# Altium project BencsikDanielZoltan_A7.PrjPcb
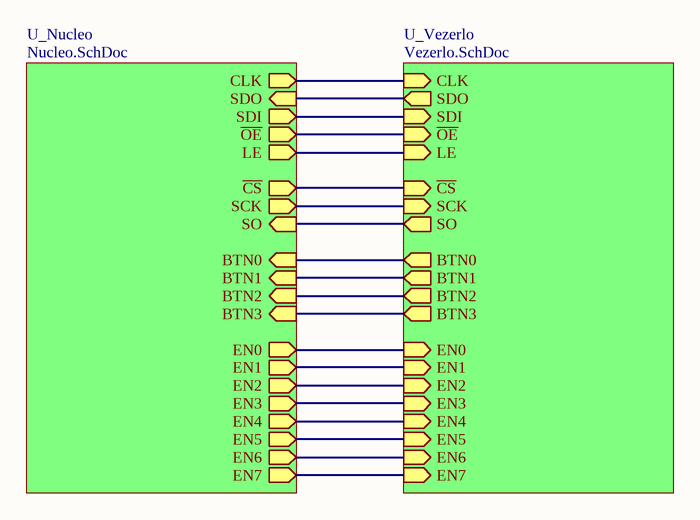
[diagram p0: TOP.SchDoc]
4 sheets, 101 parts. Net scope: hierarchical (ports join the sheet entries above them; power ports are global).
Board file: hazi_kiindulas.PcbDoc
Sheets:
  TOP.SchDoc
    U_Nucleo = Nucleo.SchDoc
    U_Vezerlo = Vezerlo.SchDoc
      U_Ledsor1 = Ledsor.SchDoc
      U_Ledsor2 = Ledsor.SchDoc
      U_Ledsor3 = Ledsor.SchDoc
      U_Ledsor4 = Ledsor.SchDoc
      U_Ledsor5 = Ledsor.SchDoc
      U_Ledsor6 = Ledsor.SchDoc
      U_Ledsor7 = Ledsor.SchDoc
      U_Ledsor8 = Ledsor.SchDoc

## Sheet TOP.SchDoc: LED Matrix
size A4; Author: Bencsik Dániel Zoltán; Organization: BME-AUT; DocumentNumber: 1; Revision: R7; SheetNumber: 1; SheetTotal: 4

### Sub-sheets
U_Nucleo = Nucleo.SchDoc: EN1 (out), EN2 (out), EN3 (out), EN4 (out), EN5 (out), EN6 (out), EN7 (out), EN0 (out), SDI (out), CLK (out), LE (out), ~{OE} (out), SDO (in), ~{CS} (out), SCK (out), SO (in), BTN0 (in), BTN1 (in), BTN2 (in), BTN3 (in)
U_Vezerlo = Vezerlo.SchDoc: SDI (in), CLK (in), LE (in), ~{OE} (in), EN0 (in), EN1 (in), EN2 (in), EN3 (in), EN4 (in), EN5 (in), EN6 (in), EN7 (in), SDO (out), ~{CS} (in), SCK (in), SO (out), BTN0 (out), BTN1 (out), BTN2 (out), BTN3 (out)

### Nets
SPI1_MISO: sheet U_Nucleo/SDO, sheet U_Vezerlo/SDO
SPI1_MOSI: sheet U_Nucleo/SDI, sheet U_Vezerlo/SDI
SPI1_SCK: sheet U_Nucleo/CLK, sheet U_Vezerlo/CLK
SPI2_MISO: sheet U_Nucleo/SO, sheet U_Vezerlo/SO
SPI2_NSS: sheet U_Nucleo/~{CS}, sheet U_Vezerlo/~{CS}
SPI2_SCK: sheet U_Nucleo/SCK, sheet U_Vezerlo/SCK
SR_LE: sheet U_Nucleo/LE, sheet U_Vezerlo/LE
SR_~{OE}: sheet U_Nucleo/~{OE}, sheet U_Vezerlo/~{OE}
NetB0_3: sheet U_Nucleo/BTN0, sheet U_Vezerlo/BTN0
NetB1_3: sheet U_Nucleo/BTN1, sheet U_Vezerlo/BTN1
NetB2_3: sheet U_Nucleo/BTN2, sheet U_Vezerlo/BTN2
NetB3_3: sheet U_Nucleo/BTN3, sheet U_Vezerlo/BTN3
NetR7A_1: sheet U_Nucleo/EN0, sheet U_Vezerlo/EN0
NetR7B_1: sheet U_Nucleo/EN1, sheet U_Vezerlo/EN1
NetR7C_1: sheet U_Nucleo/EN2, sheet U_Vezerlo/EN2
NetR7D_1: sheet U_Nucleo/EN3, sheet U_Vezerlo/EN3
NetR7E_1: sheet U_Nucleo/EN4, sheet U_Vezerlo/EN4
NetR7F_1: sheet U_Nucleo/EN5, sheet U_Vezerlo/EN5
NetR7G_1: sheet U_Nucleo/EN6, sheet U_Vezerlo/EN6
NetR7H_1: sheet U_Nucleo/EN7, sheet U_Vezerlo/EN7

### Notes on the sheet
- Title
- Size:
- Date:
- A4
- Number:
- Time:
- Revision:
- Sheet
- of
- File:

## Sheet Nucleo.SchDoc: LED Matrix
size A4; Author: Bencsik Dániel Zoltán; Organization: BME-AUT; DocumentNumber: 2; Revision: A7; SheetNumber: 2; SheetTotal: 4
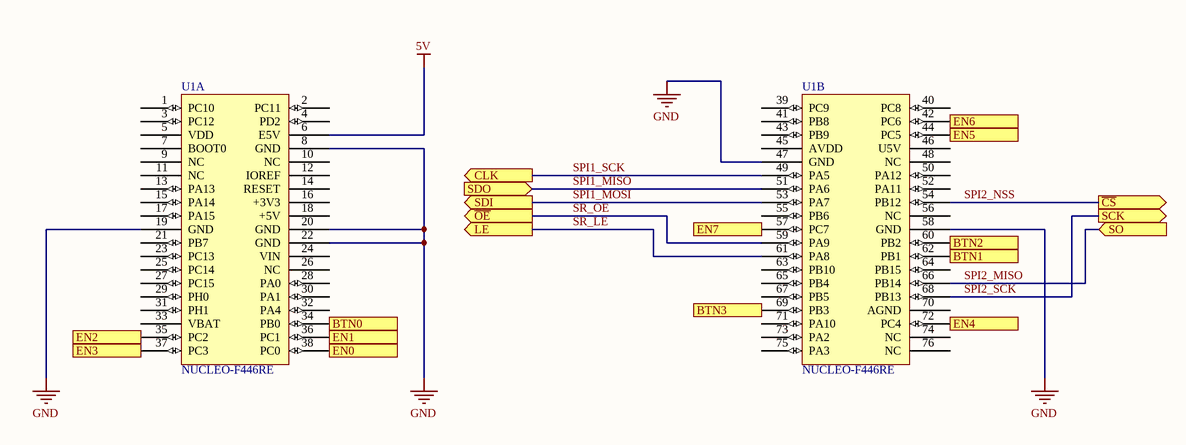
[diagram p1: Nucleo.SchDoc]

### Parts
U1  NUCLEO-F446RE  [FP_NUCLEO-64]  (parts A,B of 2)

### Ports
BTN0 (in), BTN1 (in), BTN2 (in), BTN3 (in), CLK (out), EN0 (out), EN1 (out), EN2 (out), EN3 (out), EN4 (out), EN5 (out), EN6 (out), EN7 (out), LE (out), SCK (out), SDI (out), SDO (in), SO (in), ~{CS} (out), ~{OE} (out)

### Nets
5V: U1.6(E5V)
GND: U1.8(GND) U1.19(GND) U1.20(GND) U1.22(GND) U1.47(GND) U1.58(GND)
SPI1_MISO: U1.51(PA6) ; port SDO
SPI1_MOSI: U1.53(PA7) ; port SDI
SPI1_SCK: U1.49(PA5) ; port CLK
SPI2_MISO: U1.66(PB14) ; port SO
SPI2_NSS: U1.54(PB12) ; port ~{CS}
SPI2_SCK: U1.68(PB13) ; port SCK
SR_LE: U1.61(PA8) ; port LE
SR_~{OE}: U1.59(PA9) ; port ~{OE}
NetB0_3: U1.34(PB0) ; port BTN0
NetB1_3: U1.62(PB1) ; port BTN1
NetB2_3: U1.60(PB2) ; port BTN2
NetB3_3: U1.69(PB3) ; port BTN3
NetR7A_1: U1.38(PC0) ; port EN0
NetR7B_1: U1.36(PC1) ; port EN1
NetR7C_1: U1.35(PC2) ; port EN2
NetR7D_1: U1.37(PC3) ; port EN3
NetR7E_1: U1.72(PC4) ; port EN4
NetR7F_1: U1.44(PC5) ; port EN5
NetR7G_1: U1.42(PC6) ; port EN6
NetR7H_1: U1.57(PC7) ; port EN7

Not connected (* = marked no-connect by the designer): U1 1(PC10) 2(PC11) 3(PC12) 4(PD2) 5(VDD) 7(BOOT0) 9(NC) 10(NC) 11(NC) 12(IOREF) 13(PA13) 14(RESET) 15(PA14) 16(+3V3) 17(PA15) 18(+5V) 21(PB7) 23(PC13) 24(VIN) 25(PC14) 26(NC) 27(PC15) 28(PA0) 29(PH0) 30(PA1) 31(PH1) 32(PA4) 33(VBAT) 39(PC9) 40(PC8) 41(PB8) 43(PB9) 45(AVDD) 46(U5V) 48(NC) 50(PA12) 52(PA11) 55(PB6) 56(NC) 63(PB10) 64(PB15) 65(PB4) 67(PB5) 70(AGND) 71(PA10) 73(PA2) 74(NC) 75(PA3) 76(NC)

### Notes on the sheet
- Title
- Size:
- Date:
- A4
- Number:
- Time:
- Revision:
- Sheet
- of
- File:

### Library data of the parts
U1 = NUCLEO-F446RE: Reference: NUCLEO; Name: Nucleo F446RE; Supplier: Tanszék

## Sheet Vezerlo.SchDoc: LED Matrix
size A4; Author: Bencsik Dániel Zoltán; Organization: BME-AUT; DocumentNumber: 3; Revision: A7; SheetNumber: 3; SheetTotal: 4
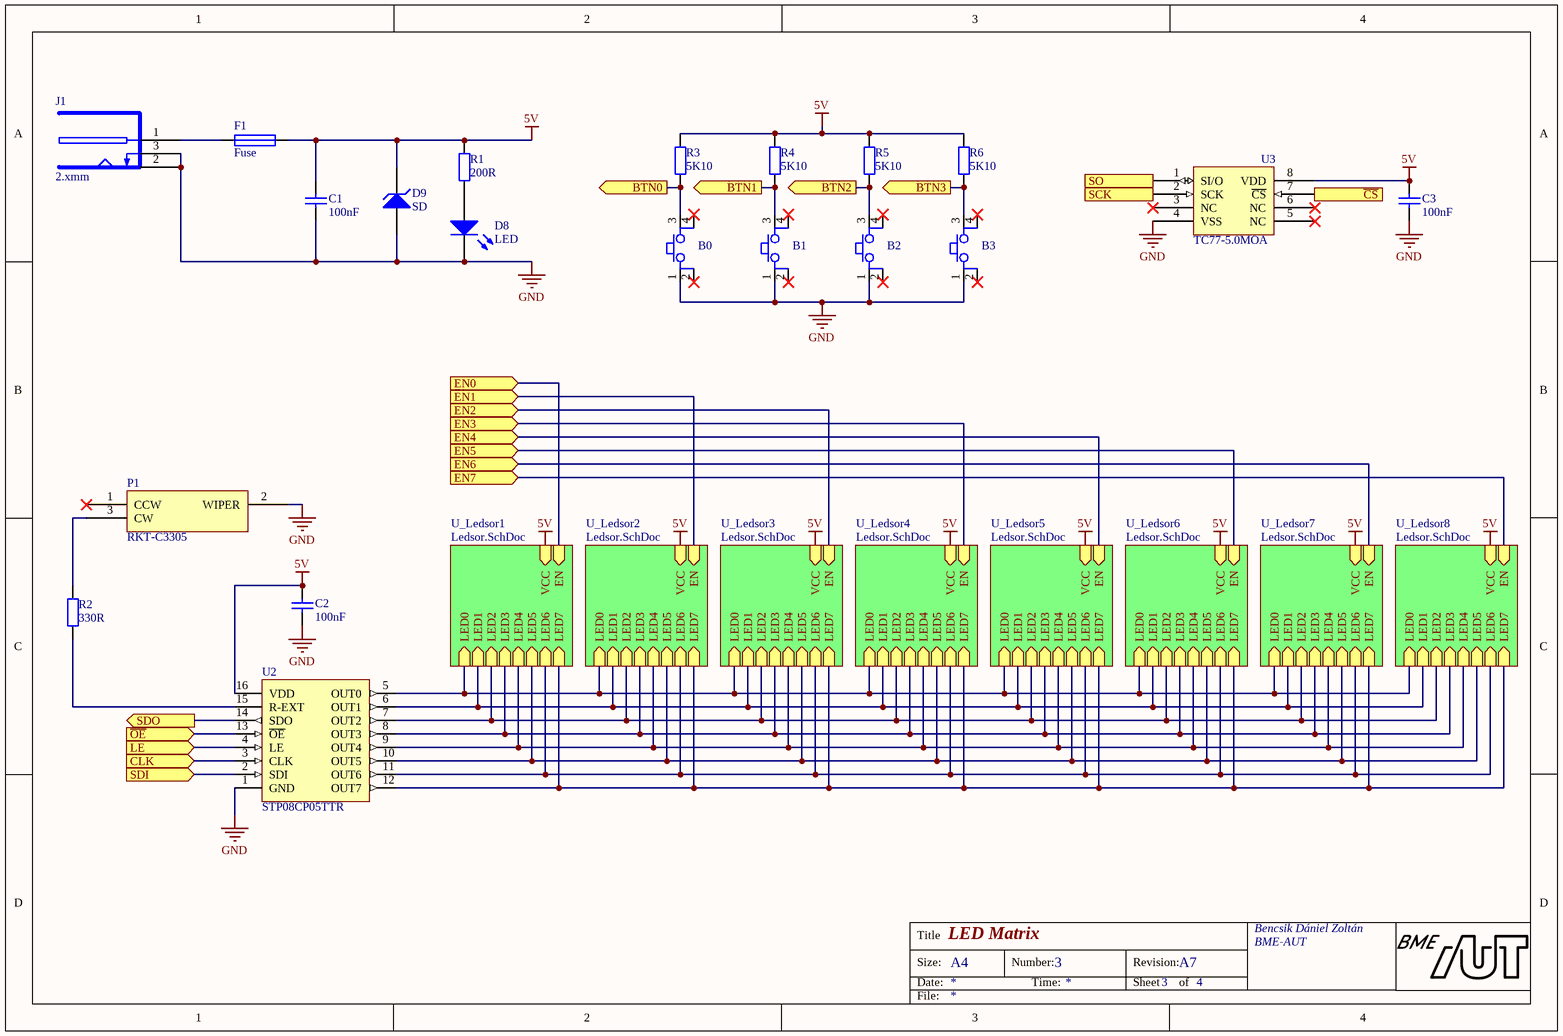
[diagram p2: Vezerlo.SchDoc]

### Parts
B0  Button  [FP_BTN_SMD]  (value not drawn)
B1  Button  [FP_BTN_SMD]  (value not drawn)
B2  Button  [FP_BTN_SMD]  (value not drawn)
B3  Button  [FP_BTN_SMD]  (value not drawn)
C1  100nF  [FP_0603_CAP_080]
C2  100nF  [FP_0603_CAP_080]
C3  100nF  [FP_0603_CAP_080]
D8  LED  [HF_FP_0805_LED_BLUE&RED_2]
D9  SD  [FP_SMA]
F1  Fuse  [FP_MULTIFUSE]
J1  2.xmm  [FP_DC_TAP_ANYA]
P1  RKT-C3305  [HF_POT]
R1  200R  [HF_FP_0603_RES]
R2  330R  [HF_FP_0603_RES]
R3  5K10  [HF_FP_0603_RES]
R4  5K10  [HF_FP_0603_RES]
R5  5K10  [HF_FP_0603_RES]
R6  5K10  [HF_FP_0603_RES]
U2  STP08CP05TTR  [TSOP65P640X120-16M]
U3  TC77-5.0MOA  [HF_SOIC127P599X175-8N]

### Sub-sheets
U_Ledsor1 = Ledsor.SchDoc: LED0 (in), LED1 (in), LED2 (in), LED3 (in), LED4 (in), LED5 (in), LED6 (in), LED7 (in), EN (in), VCC (in)
U_Ledsor2 = Ledsor.SchDoc: LED0 (in), LED1 (in), LED2 (in), LED3 (in), LED4 (in), LED5 (in), LED6 (in), LED7 (in), EN (in), VCC (in)
U_Ledsor3 = Ledsor.SchDoc: LED0 (in), LED1 (in), LED2 (in), LED3 (in), LED4 (in), LED5 (in), LED6 (in), LED7 (in), EN (in), VCC (in)
U_Ledsor4 = Ledsor.SchDoc: LED0 (in), LED1 (in), LED2 (in), LED3 (in), LED4 (in), LED5 (in), LED6 (in), LED7 (in), EN (in), VCC (in)
U_Ledsor5 = Ledsor.SchDoc: LED0 (in), LED1 (in), LED2 (in), LED3 (in), LED4 (in), LED5 (in), LED6 (in), LED7 (in), EN (in), VCC (in)
U_Ledsor6 = Ledsor.SchDoc: LED0 (in), LED1 (in), LED2 (in), LED3 (in), LED4 (in), LED5 (in), LED6 (in), LED7 (in), EN (in), VCC (in)
U_Ledsor7 = Ledsor.SchDoc: LED0 (in), LED1 (in), LED2 (in), LED3 (in), LED4 (in), LED5 (in), LED6 (in), LED7 (in), EN (in), VCC (in)
U_Ledsor8 = Ledsor.SchDoc: LED0 (in), LED1 (in), LED2 (in), LED3 (in), LED4 (in), LED5 (in), LED6 (in), LED7 (in), EN (in), VCC (in)

### Ports
BTN0 (out), BTN1 (out), BTN2 (out), BTN3 (out), CLK (in), EN0 (in), EN1 (in), EN2 (in), EN3 (in), EN4 (in), EN5 (in), EN6 (in), EN7 (in), LE (in), SCK (in), SDI (in), SDO (out), SO (out), ~{CS} (in), ~{OE} (in)

### Nets
5V: C1.2 C2.2 C3.2 D9.K F1.2 R1.2 R3.2 R4.2 R5.2 R6.2 U2.16(VDD) U3.8(VDD) ; sheet U_Ledsor1/VCC, sheet U_Ledsor2/VCC, sheet U_Ledsor3/VCC, sheet U_Ledsor4/VCC, sheet U_Ledsor5/VCC, sheet U_Ledsor6/VCC, sheet U_Ledsor7/VCC, sheet U_Ledsor8/VCC
GND: B0.1 B1.1 B2.1 B3.1 C1.1 C2.1 C3.1 D8.K D9.A J1.2(SLEEVE) J1.3(BREAK) P1.2(WIPER) U2.1(GND) U3.4(VSS)
SPI1_MISO: U2.14(SDO) ; port SDO
SPI1_MOSI: U2.2(SDI) ; port SDI
SPI1_SCK: U2.3(CLK) ; port CLK
SPI2_MISO: U3.1(SI/O) ; port SO
SPI2_NSS: U3.7(~{CS}) ; port ~{CS}
SPI2_SCK: U3.2(SCK) ; port SCK
SR_LE: U2.4(LE) ; port LE
SR_~{OE}: U2.13(~{OE}) ; port ~{OE}
NetB0_3: B0.3 R3.1 ; port BTN0
NetB1_3: B1.3 R4.1 ; port BTN1
NetB2_3: B2.3 R5.1 ; port BTN2
NetB3_3: B3.3 R6.1 ; port BTN3
NetD0#1_K: U2.5(OUT0) ; sheet U_Ledsor1/LED0, sheet U_Ledsor2/LED0, sheet U_Ledsor3/LED0, sheet U_Ledsor4/LED0, sheet U_Ledsor5/LED0, sheet U_Ledsor6/LED0, sheet U_Ledsor7/LED0, sheet U_Ledsor8/LED0
NetD1#1_K: U2.6(OUT1) ; sheet U_Ledsor1/LED1, sheet U_Ledsor2/LED1, sheet U_Ledsor3/LED1, sheet U_Ledsor4/LED1, sheet U_Ledsor5/LED1, sheet U_Ledsor6/LED1, sheet U_Ledsor7/LED1, sheet U_Ledsor8/LED1
NetD2#1_K: U2.7(OUT2) ; sheet U_Ledsor1/LED2, sheet U_Ledsor2/LED2, sheet U_Ledsor3/LED2, sheet U_Ledsor4/LED2, sheet U_Ledsor5/LED2, sheet U_Ledsor6/LED2, sheet U_Ledsor7/LED2, sheet U_Ledsor8/LED2
NetD3#1_K: U2.8(OUT3) ; sheet U_Ledsor1/LED3, sheet U_Ledsor2/LED3, sheet U_Ledsor3/LED3, sheet U_Ledsor4/LED3, sheet U_Ledsor5/LED3, sheet U_Ledsor6/LED3, sheet U_Ledsor7/LED3, sheet U_Ledsor8/LED3
NetD4#1_K: U2.9(OUT4) ; sheet U_Ledsor1/LED4, sheet U_Ledsor2/LED4, sheet U_Ledsor3/LED4, sheet U_Ledsor4/LED4, sheet U_Ledsor5/LED4, sheet U_Ledsor6/LED4, sheet U_Ledsor7/LED4, sheet U_Ledsor8/LED4
NetD5#1_K: U2.10(OUT5) ; sheet U_Ledsor1/LED5, sheet U_Ledsor2/LED5, sheet U_Ledsor3/LED5, sheet U_Ledsor4/LED5, sheet U_Ledsor5/LED5, sheet U_Ledsor6/LED5, sheet U_Ledsor7/LED5, sheet U_Ledsor8/LED5
NetD6#1_K: U2.11(OUT6) ; sheet U_Ledsor1/LED6, sheet U_Ledsor2/LED6, sheet U_Ledsor3/LED6, sheet U_Ledsor4/LED6, sheet U_Ledsor5/LED6, sheet U_Ledsor6/LED6, sheet U_Ledsor7/LED6, sheet U_Ledsor8/LED6
NetD7#1_K: U2.12(OUT7) ; sheet U_Ledsor1/LED7, sheet U_Ledsor2/LED7, sheet U_Ledsor3/LED7, sheet U_Ledsor4/LED7, sheet U_Ledsor5/LED7, sheet U_Ledsor6/LED7, sheet U_Ledsor7/LED7, sheet U_Ledsor8/LED7
NetD8_A: D8.A R1.1
NetF1_1: F1.1 J1.1(PIN)
NetP1_3: P1.3(CW) R2.2
NetR2_1: R2.1 U2.15(R-EXT)
NetR7A_1: port EN0, sheet U_Ledsor1/EN
NetR7B_1: port EN1, sheet U_Ledsor2/EN
NetR7C_1: port EN2, sheet U_Ledsor3/EN
NetR7D_1: port EN3, sheet U_Ledsor4/EN
NetR7E_1: port EN4, sheet U_Ledsor5/EN
NetR7F_1: port EN5, sheet U_Ledsor6/EN
NetR7G_1: port EN6, sheet U_Ledsor7/EN
NetR7H_1: port EN7, sheet U_Ledsor8/EN

Not connected (* = marked no-connect by the designer): B0 2* 4*; B1 2* 4*; B2 2* 4*; B3 2* 4*; P1 1(CCW)*; U3 3(NC)* 5(NC)* 6(NC)*

### Notes on the sheet
- Title
- Size:
- Date:
- A4
- Number:
- Time:
- Revision:
- Sheet
- of
- File:

### Library data of the parts
B0-B3 = Button 4P: Push button; Name: TACT 6x 6 4P SPST 2 FSM4JSMA (TYC) 50mA 12VDC SMD H=5mm 160g BLACK B. 4-1437565-1; Reference: 45-05-43; Supplier: Lomex
C1-C3 = CAP: Capacitor; Name: 100nF 0603 10% 50V X7R CC0603KPX7R9BB104 (YAG); Supplier: Lomex; Reference: 82-12-71; Value: 100nF
D8 = LED: Typical RED GaAs LED; Name: 2012 RED 631nm 80mcd FYLS-0805URC (FYL) W.CLEAR 2x1.2x0.8mm 0805 130°; Supplier: Lomex; Reference: 95-02-74
D9 = ZENER: Zener Diode; U_Z: 24; Reference: 1815679; Name: SMAJ5.0A-E3/5A; Supplier: Farnell
F1 = Fuse: Name: 1.25A 15V 1812L125/16DR POLYFUSE SMD 1812 (LFS) ˝LF125-16˝; Reference: 44-04-71; Supplier: Lomex
J1 = DC_TAP_ANYA: 2.xmm DC HEBA25 TÁPFESZÜLTSÉG ALJZAT ZÁRT, NYÁKBA 90°; Name: TÁP DC ANYA 5.5/2.1/9.5mm DCS-5521-5; Supplier: Lomex; Reference: 43-07-67
P1 = RKT-C3305: TRIMMER POTENTIOMETER-3mm SMD; Name: 10K0 3305-103R (KIC) 3x3.5mm CERMET; Supplier: Lomex; Reference: 90-00-58
R1 = RES: Resistor; Name: 200R 0603 5% RK73B1JTTD201J 0.1W (KOA) Ł; Supplier: Lomex; Reference: 81-04-08; Value: 200R
R2 = RES: Resistor; Name: 330R 0603 5% WR06X331JTL 0.1W (WAL); Supplier: Lomex; Reference: 81-17-48; Value: 330R
R3-R6 = RES: Resistor; Name: 5K10 0603 5% WR06X512JTL 0.1W (WAL); Supplier: Lomex; Reference: 81-28-96; Value: 5K10
U2 = STP08CP05TTR: Low voltage, low current power 8-bit shift register; Supplier: Tanszék; Reference: STP08CP05TTR; Name: STP08CP05TTR
U3 = TC77-5.0MOA: Thermal Sensor with SPI Interface; Reference: 1439514; Supplier: Farnell; Name: TC77-5.0MOA

## Sheet Ledsor.SchDoc: LED Matrix
size A4; Author: Bencsik Dániel Zoltán; Organization: BME-AUT; DocumentNumber: 4; Revision: A7; SheetNumber: 4; SheetTotal: 4
Used 8 times, as channels U_Vezerlo/U_Ledsor1, U_Vezerlo/U_Ledsor2, U_Vezerlo/U_Ledsor3, U_Vezerlo/U_Ledsor4, U_Vezerlo/U_Ledsor5, U_Vezerlo/U_Ledsor6, U_Vezerlo/U_Ledsor7, U_Vezerlo/U_Ledsor8. Parts and nets are listed once, with the designators drawn on the sheet.
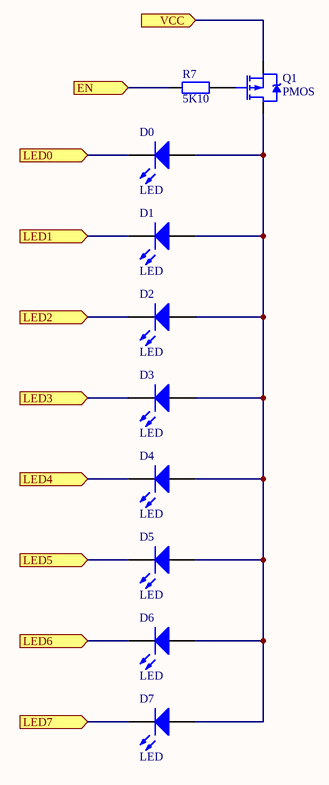
[diagram p3: Ledsor.SchDoc]

### Parts
D0  LED  [HF_FP_0805_LED_BLUE]
D1  LED  [HF_FP_0805_LED_BLUE]
D2  LED  [HF_FP_0805_LED_BLUE]
D3  LED  [HF_FP_0805_LED_BLUE]
D4  LED  [HF_FP_0805_LED_BLUE]
D5  LED  [HF_FP_0805_LED_BLUE]
D6  LED  [HF_FP_0805_LED_BLUE]
D7  LED  [HF_FP_0805_LED_BLUE]
Q1  PMOS  [FP_SOT23-3]
R7  5K10  [HF_FP_0603_RES]

### Ports
EN (in), LED0 (in), LED1 (in), LED2 (in), LED3 (in), LED4 (in), LED5 (in), LED6 (in), LED7 (in), VCC (in)

### Nets
EN: R7.1 ; port EN
LED0: D0.K ; port LED0
LED1: D1.K ; port LED1
LED2: D2.K ; port LED2
LED3: D3.K ; port LED3
LED4: D4.K ; port LED4
LED5: D5.K ; port LED5
LED6: D6.K ; port LED6
LED7: D7.K ; port LED7
VCC: Q1.2(S) ; port VCC
NetD0_A: D0.A D1.A D2.A D3.A D4.A D5.A D6.A D7.A Q1.3(D)
NetQ1_1: Q1.1(G) R7.2

### Channels
U_Vezerlo/U_Ledsor1: designators D0=D0#1 D1=D1#1 D2=D2#1 D3=D3#1 D4=D4#1 D5=D5#1 D6=D6#1 D7=D7#1 Q1=Q1#1 R7=R7A; ports EN=NetR7A_1 LED0=NetD0#1_K LED1=NetD1#1_K LED2=NetD2#1_K LED3=NetD3#1_K LED4=NetD4#1_K LED5=NetD5#1_K LED6=NetD6#1_K LED7=NetD7#1_K VCC=5V
U_Vezerlo/U_Ledsor2: designators D0=D0#2 D1=D1#2 D2=D2#2 D3=D3#2 D4=D4#2 D5=D5#2 D6=D6#2 D7=D7#2 Q1=Q1#2 R7=R7B; ports EN=NetR7B_1 LED0=NetD0#1_K LED1=NetD1#1_K LED2=NetD2#1_K LED3=NetD3#1_K LED4=NetD4#1_K LED5=NetD5#1_K LED6=NetD6#1_K LED7=NetD7#1_K VCC=5V
U_Vezerlo/U_Ledsor3: designators D0=D0#3 D1=D1#3 D2=D2#3 D3=D3#3 D4=D4#3 D5=D5#3 D6=D6#3 D7=D7#3 Q1=Q1#3 R7=R7C; ports EN=NetR7C_1 LED0=NetD0#1_K LED1=NetD1#1_K LED2=NetD2#1_K LED3=NetD3#1_K LED4=NetD4#1_K LED5=NetD5#1_K LED6=NetD6#1_K LED7=NetD7#1_K VCC=5V
U_Vezerlo/U_Ledsor4: designators D0=D0#4 D1=D1#4 D2=D2#4 D3=D3#4 D4=D4#4 D5=D5#4 D6=D6#4 D7=D7#4 Q1=Q1#4 R7=R7D; ports EN=NetR7D_1 LED0=NetD0#1_K LED1=NetD1#1_K LED2=NetD2#1_K LED3=NetD3#1_K LED4=NetD4#1_K LED5=NetD5#1_K LED6=NetD6#1_K LED7=NetD7#1_K VCC=5V
U_Vezerlo/U_Ledsor5: designators D0=D0#5 D1=D1#5 D2=D2#5 D3=D3#5 D4=D4#5 D5=D5#5 D6=D6#5 D7=D7#5 Q1=Q1#5 R7=R7E; ports EN=NetR7E_1 LED0=NetD0#1_K LED1=NetD1#1_K LED2=NetD2#1_K LED3=NetD3#1_K LED4=NetD4#1_K LED5=NetD5#1_K LED6=NetD6#1_K LED7=NetD7#1_K VCC=5V
U_Vezerlo/U_Ledsor6: designators D0=D0#6 D1=D1#6 D2=D2#6 D3=D3#6 D4=D4#6 D5=D5#6 D6=D6#6 D7=D7#6 Q1=Q1#6 R7=R7F; ports EN=NetR7F_1 LED0=NetD0#1_K LED1=NetD1#1_K LED2=NetD2#1_K LED3=NetD3#1_K LED4=NetD4#1_K LED5=NetD5#1_K LED6=NetD6#1_K LED7=NetD7#1_K VCC=5V
U_Vezerlo/U_Ledsor7: designators D0=D0#7 D1=D1#7 D2=D2#7 D3=D3#7 D4=D4#7 D5=D5#7 D6=D6#7 D7=D7#7 Q1=Q1#7 R7=R7G; ports EN=NetR7G_1 LED0=NetD0#1_K LED1=NetD1#1_K LED2=NetD2#1_K LED3=NetD3#1_K LED4=NetD4#1_K LED5=NetD5#1_K LED6=NetD6#1_K LED7=NetD7#1_K VCC=5V
U_Vezerlo/U_Ledsor8: designators D0=D0#8 D1=D1#8 D2=D2#8 D3=D3#8 D4=D4#8 D5=D5#8 D6=D6#8 D7=D7#8 Q1=Q1#8 R7=R7H; ports EN=NetR7H_1 LED0=NetD0#1_K LED1=NetD1#1_K LED2=NetD2#1_K LED3=NetD3#1_K LED4=NetD4#1_K LED5=NetD5#1_K LED6=NetD6#1_K LED7=NetD7#1_K VCC=5V

### Notes on the sheet
- Title
- Size:
- Date:
- A4
- Number:
- Time:
- Revision:
- Sheet
- of
- File:

### Library data of the parts
D0-D7 = LED: Typical RED GaAs LED
Q1 = PMOS: MOSFET, P CH; Name: BSS84AK (NXP) P-FET 50V 0.18A <7.5R SOT-23 ˝VS˝; Supplier: Lomex; Reference: 86-05-45
R7 = RES: as R3 on sheet Vezerlo; Supplier: Lomex; Reference: 81-28-96; Value: 5K10

## Nets that join several sheets
5V: Nucleo (U1.6), Vezerlo (12 pins), U_Vezerlo/U_Ledsor1 (Q1#1.2), U_Vezerlo/U_Ledsor2 (Q1#2.2), U_Vezerlo/U_Ledsor3 (Q1#3.2), U_Vezerlo/U_Ledsor4 (Q1#4.2), U_Vezerlo/U_Ledsor5 (Q1#5.2), U_Vezerlo/U_Ledsor6 (Q1#6.2), U_Vezerlo/U_Ledsor7 (Q1#7.2), U_Vezerlo/U_Ledsor8 (Q1#8.2)
GND: Nucleo (6 pins), Vezerlo (14 pins)
NetB0_3: Nucleo (U1.34), Vezerlo (B0.3 R3.1)
NetB1_3: Nucleo (U1.62), Vezerlo (B1.3 R4.1)
NetB2_3: Nucleo (U1.60), Vezerlo (B2.3 R5.1)
NetB3_3: Nucleo (U1.69), Vezerlo (B3.3 R6.1)
NetD0#1_K: Vezerlo (U2.5), U_Vezerlo/U_Ledsor1 (D0#1.K), U_Vezerlo/U_Ledsor2 (D0#2.K), U_Vezerlo/U_Ledsor3 (D0#3.K), U_Vezerlo/U_Ledsor4 (D0#4.K), U_Vezerlo/U_Ledsor5 (D0#5.K), U_Vezerlo/U_Ledsor6 (D0#6.K), U_Vezerlo/U_Ledsor7 (D0#7.K), U_Vezerlo/U_Ledsor8 (D0#8.K)
NetD1#1_K: Vezerlo (U2.6), U_Vezerlo/U_Ledsor1 (D1#1.K), U_Vezerlo/U_Ledsor2 (D1#2.K), U_Vezerlo/U_Ledsor3 (D1#3.K), U_Vezerlo/U_Ledsor4 (D1#4.K), U_Vezerlo/U_Ledsor5 (D1#5.K), U_Vezerlo/U_Ledsor6 (D1#6.K), U_Vezerlo/U_Ledsor7 (D1#7.K), U_Vezerlo/U_Ledsor8 (D1#8.K)
NetD2#1_K: Vezerlo (U2.7), U_Vezerlo/U_Ledsor1 (D2#1.K), U_Vezerlo/U_Ledsor2 (D2#2.K), U_Vezerlo/U_Ledsor3 (D2#3.K), U_Vezerlo/U_Ledsor4 (D2#4.K), U_Vezerlo/U_Ledsor5 (D2#5.K), U_Vezerlo/U_Ledsor6 (D2#6.K), U_Vezerlo/U_Ledsor7 (D2#7.K), U_Vezerlo/U_Ledsor8 (D2#8.K)
NetD3#1_K: Vezerlo (U2.8), U_Vezerlo/U_Ledsor1 (D3#1.K), U_Vezerlo/U_Ledsor2 (D3#2.K), U_Vezerlo/U_Ledsor3 (D3#3.K), U_Vezerlo/U_Ledsor4 (D3#4.K), U_Vezerlo/U_Ledsor5 (D3#5.K), U_Vezerlo/U_Ledsor6 (D3#6.K), U_Vezerlo/U_Ledsor7 (D3#7.K), U_Vezerlo/U_Ledsor8 (D3#8.K)
NetD4#1_K: Vezerlo (U2.9), U_Vezerlo/U_Ledsor1 (D4#1.K), U_Vezerlo/U_Ledsor2 (D4#2.K), U_Vezerlo/U_Ledsor3 (D4#3.K), U_Vezerlo/U_Ledsor4 (D4#4.K), U_Vezerlo/U_Ledsor5 (D4#5.K), U_Vezerlo/U_Ledsor6 (D4#6.K), U_Vezerlo/U_Ledsor7 (D4#7.K), U_Vezerlo/U_Ledsor8 (D4#8.K)
NetD5#1_K: Vezerlo (U2.10), U_Vezerlo/U_Ledsor1 (D5#1.K), U_Vezerlo/U_Ledsor2 (D5#2.K), U_Vezerlo/U_Ledsor3 (D5#3.K), U_Vezerlo/U_Ledsor4 (D5#4.K), U_Vezerlo/U_Ledsor5 (D5#5.K), U_Vezerlo/U_Ledsor6 (D5#6.K), U_Vezerlo/U_Ledsor7 (D5#7.K), U_Vezerlo/U_Ledsor8 (D5#8.K)
NetD6#1_K: Vezerlo (U2.11), U_Vezerlo/U_Ledsor1 (D6#1.K), U_Vezerlo/U_Ledsor2 (D6#2.K), U_Vezerlo/U_Ledsor3 (D6#3.K), U_Vezerlo/U_Ledsor4 (D6#4.K), U_Vezerlo/U_Ledsor5 (D6#5.K), U_Vezerlo/U_Ledsor6 (D6#6.K), U_Vezerlo/U_Ledsor7 (D6#7.K), U_Vezerlo/U_Ledsor8 (D6#8.K)
NetD7#1_K: Vezerlo (U2.12), U_Vezerlo/U_Ledsor1 (D7#1.K), U_Vezerlo/U_Ledsor2 (D7#2.K), U_Vezerlo/U_Ledsor3 (D7#3.K), U_Vezerlo/U_Ledsor4 (D7#4.K), U_Vezerlo/U_Ledsor5 (D7#5.K), U_Vezerlo/U_Ledsor6 (D7#6.K), U_Vezerlo/U_Ledsor7 (D7#7.K), U_Vezerlo/U_Ledsor8 (D7#8.K)
NetR7A_1: Nucleo (U1.38), U_Vezerlo/U_Ledsor1 (R7A.1)
NetR7B_1: Nucleo (U1.36), U_Vezerlo/U_Ledsor2 (R7B.1)
NetR7C_1: Nucleo (U1.35), U_Vezerlo/U_Ledsor3 (R7C.1)
NetR7D_1: Nucleo (U1.37), U_Vezerlo/U_Ledsor4 (R7D.1)
NetR7E_1: Nucleo (U1.72), U_Vezerlo/U_Ledsor5 (R7E.1)
NetR7F_1: Nucleo (U1.44), U_Vezerlo/U_Ledsor6 (R7F.1)
NetR7G_1: Nucleo (U1.42), U_Vezerlo/U_Ledsor7 (R7G.1)
NetR7H_1: Nucleo (U1.57), U_Vezerlo/U_Ledsor8 (R7H.1)
SPI1_MISO: Nucleo (U1.51), Vezerlo (U2.14)
SPI1_MOSI: Nucleo (U1.53), Vezerlo (U2.2)
SPI1_SCK: Nucleo (U1.49), Vezerlo (U2.3)
SPI2_MISO: Nucleo (U1.66), Vezerlo (U3.1)
SPI2_NSS: Nucleo (U1.54), Vezerlo (U3.7)
SPI2_SCK: Nucleo (U1.68), Vezerlo (U3.2)
SR_LE: Nucleo (U1.61), Vezerlo (U2.4)
SR_~{OE}: Nucleo (U1.59), Vezerlo (U2.13)